# Altium schematic sheet ICs.SchDoc
size 381 x 241 mm; SheetNumber: 3; SheetTotal: 4
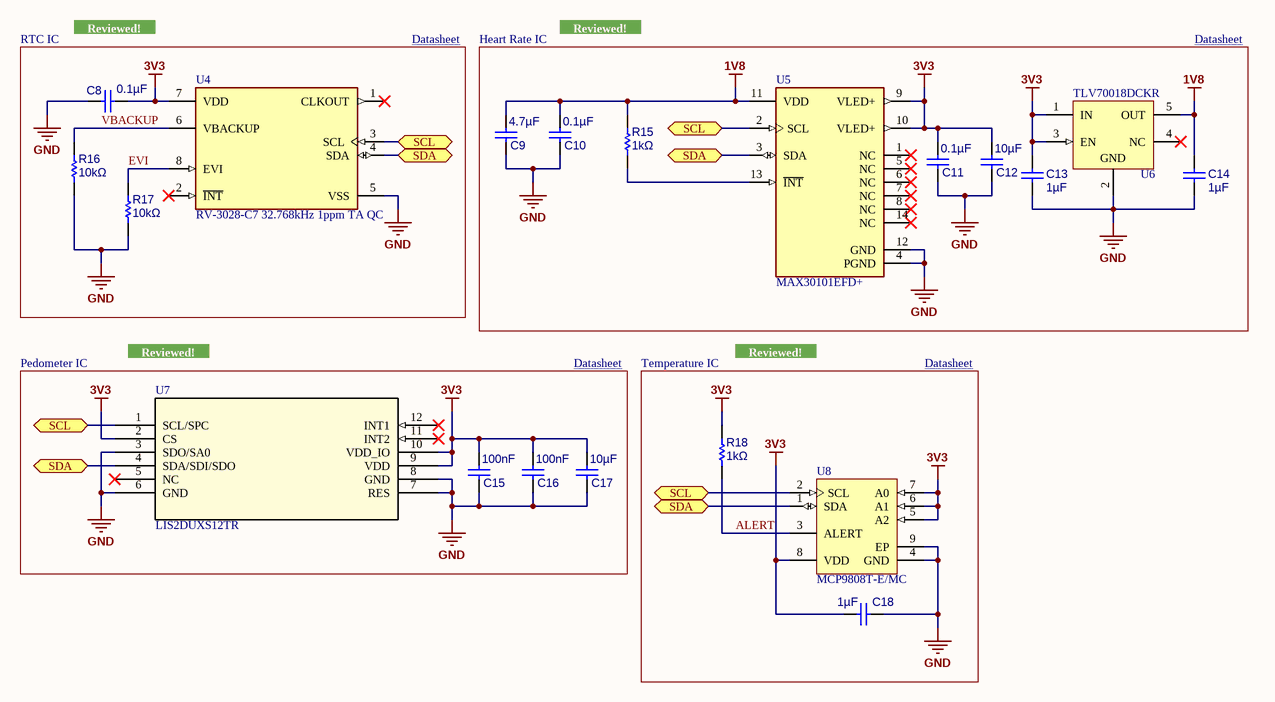
[diagram p0: ICs.SchDoc]

## Parts
C8  0.1µF  [WCAP-CSGP_0603_L1.6W0.8H0.8_Reflow]
C9  4.7µF  [WCAP-CSGP_0603_L1.6W0.8H0.8_Reflow]
C10  0.1µF  [WCAP-CSGP_0603_L1.6W0.8H0.8_Reflow]
C11  0.1µF  [WCAP-CSGP_0603_L1.6W0.8H0.8_Reflow]
C12  10µF  [WCAP-CSGP_0603_L1.6W0.8H0.8_Reflow]
C13  1µF  [WCAP-CSGP_0603_L1.6W0.8H0.8_Reflow]
C14  1µF  [WCAP-CSGP_0603_L1.6W0.8H0.8_Reflow]
C15  100nF  [WCAP-CSGP_0603_L1.6W0.8H0.8_Reflow]
C16  100nF  [WCAP-CSGP_0603_L1.6W0.8H0.8_Reflow]
C17  10µF  [WCAP-CSGP_0603_L1.6W0.8H0.8_Reflow]
C18  1µF  [WCAP-CSGP_0603_L1.6W0.8H0.8_Reflow]
R15  1kΩ  [RESC1608X55X25NL10T15]
R16  10kΩ  [RESC1608X55X25NL10T15]
R17  10kΩ  [RESC1608X55X25NL10T15]
R18  1kΩ  [RESC1608X55X25NL10T15]
U4  RV-3028-C7 32.768kHz 1ppm TA QC  [FP-RV-3028-C7_32_768kHz_1-MFG]
U5  MAX30101EFD+  [FP-F143A5-1-MFG]
U6  TLV70018DCKR  [DCK0005A_L]
U7  LIS2DUXS12TR  [QFN_DUXS12_STM]
U8  MCP9808T-E/MC  [MCHP-DFN-MC8_V]

## Ports
SCL (bidir, see Display[2B], ICs[2C], ICs[3B], ICs[4B], Microcontroller[3A]), SCL (bidir, see Display[2B], ICs[2C], ICs[3B], ICs[4C], Microcontroller[3A]), SCL (bidir, see Display[2B], ICs[2C], ICs[4B], ICs[4C], Microcontroller[3A]), SCL (bidir, see Display[2B], ICs[3B], ICs[4B], ICs[4C], Microcontroller[3A]), SDA (bidir, see Display[2B], ICs[2C], ICs[3B], ICs[4B], Microcontroller[3A]), SDA (bidir, see Display[2B], ICs[2C], ICs[3B], ICs[4C], Microcontroller[3A]), SDA (bidir, see Display[2B], ICs[2C], ICs[4B], ICs[4C], Microcontroller[3A]), SDA (bidir, see Display[2B], ICs[3B], ICs[4B], ICs[4C], Microcontroller[3A])

## Nets
1V8: C9.1 C10.1 C14.2 R15.2 U5.11(VDD) U6.5(OUT)
3V3: C8.1 C11.1 C12.1 C13.2 C15.1 C16.1 C17.1 C18.1 R18.2 U4.7(VDD) U5.9(VLED+) U5.10(VLED+) U6.1(IN) U6.3(EN) U7.2(CS) U7.9(VDD) U7.10(VDD_IO) U8.5(A2) U8.6(A1) U8.7(A0) U8.8(VDD)
GND: C8.2 C9.2 C10.2 C11.2 C12.2 C13.1 C14.1 C15.2 C16.2 C17.2 C18.2 R16.1 R17.1 U4.5(VSS) U5.4(PGND) U5.12(GND) U6.2(GND) U7.3(SDO/SA0) U7.6(GND) U7.7(RES) U7.8(GND) U8.4(GND) U8.9(EP)
ALERT: R18.1 U8.3(ALERT)
EVI: R17.2 U4.8(EVI)
SCL: U4.3(SCL) U5.2(SCL) U7.1(SCL/SPC) U8.2(SCL) ; port SCL
SDA: U4.4(SDA) U5.3(SDA) U7.4(SDA/SDI/SDO) U8.1(SDA) ; port SDA
VBACKUP: R16.2 U4.6(VBACKUP)
NetR15_1: R15.1 U5.13(~{INT})

Not connected (* = marked no-connect by the designer): U4 1(CLKOUT)* 2(~{INT})*; U5 1(NC)* 5(NC)* 6(NC)* 7(NC)* 8(NC)* 14(NC)*; U6 4(NC)*; U7 5(NC)* 11(INT2)* 12(INT1)*

## Notes on the sheet
- Reviewed!
- RTC IC
- Datasheet <https://www.microcrystal.com/fileadmin/Media/Products/RTC/App.Manual/RV-3028-C7_App-Manual.pdf>
- Heart Rate IC
- Datasheet <https://datasheets.maximintegrated.com/en/ds/MAX30101.pdf>
- Pedometer IC
- Datasheet <https://www.st.com/resource/en/datasheet/lis2dux12.pdf>
- Temperature IC
- Datasheet <https://ww1.microchip.com/downloads/en/DeviceDoc/MCP9808-0.5C-Maximum-Accuracy-Digital-Temperature-Sensor-Data-Sheet-DS20005095B.pdf>

## Library data of the parts
C8-C18 = CMP-207839-000060-3: 10V tolerance
R15-R18 = CMP-2000-04186-1
U4 = CMP-226158-000001-1: Real Time Clock Serial 2byte Clock/Calendar/Alarm/Timer/Battery Backup 8-Pin CSMD T/R; Manufacturer: Micro Crystal; Memory Size: 2Bytes; Number Of Outputs: 1; Nominal Supply Current: 0.04uA; Interface: I2C; Max Supply Voltage: 5.5V; Min Supply Voltage: 1.1V; Package: RV-3028-C7 32.768kHz 1ppm TA QC; Lead Free: Yes; RoHS: TRUE; Device Class L1: Integrated Circuits (ICs); Temperature: -40°C to +85°C; ComponentLink2Description: Datasheet; Height: 0.8mm; Octopart: https://octopart.com/rv-3028-c7+32.768khz+1ppm+ta+qc-micro+crystal-98880451; ComponentLink2URL: https://www.microcrystal.com/fileadmin/Media/Products/RTC/Datasheet/RV-3028-C7.pdf; Device Class L2: Clock and Timing; Temperature Range Low: -40°C; Temperature Range High: +85°C; Automotive: No; Device Class L3: Real Time Clocks; Manufacturer Part Number: RV-3028-C7 32.768kHz 1ppm TA QC; Frequency: 32.768kHz; Ambient Temperature Range High: +85°C; Ambient Temperature Range Low: -40°C; Category: IC; Mouser Description: RV-3028-C7 32.768KHZ 1PPM Ta Qc
U5 = CMP-05738-000001-1: INTEGRATED OPTICAL SENSOR; Manufacturer: Maxim Integrated; Max Supply Voltage: 2V; Max Junction Temp: +90°C; Operating Supply Current: 600uA; Min Supply Voltage: 1.7V; Sensor Output: I2C; RoHS: TRUE; Footprint Url: https://pdfserv.maximintegrated.com/land_patterns/90-0602.PDF; Manufacturer Part Number: MAX30101EFD+; Device Class L2: unset; Temperature Range Low: -40°C; Automotive: No; Height: 1.65mm; Temperature Range High: +85°C; ComponentLink2Description: Datasheet; Mouser Description: INTEGRATED OPTICAL SENSOR; ComponentLink2URL: https://datasheets.maximintegrated.com/en/ds/MAX30101.pdf; Octopart: https://octopart.com/max30101efd%2B-maxim+integrated-57054333; Temperature: -40°C to +85°C; Package: F143A5-1; Lead Free: Yes; Device Class L1: Sensors; Digikey Description: INTEGRATED OPTICAL SENSOR; Category: IC; Device Class L3: unset
U6 = CMP-0394-00928-2: Single Output LDO, 200 mA, Fixed 1.8 V Output, 2 to 5.5 V Input, with Low IQ, 5-pin SC70 (DCK), -40 to 125 degC, Green (RoHS & no Sb/Br); Manufacturer: Texas Instruments; Vout Adj(Max)(V): 1.8; Vin(Max)(V): 5.5; SubFamily: Single Channel LDO; Iout(Max)(A): 0.2; Iq(Typ)(mA): 0.03; Accuracy(%): 2; Vdo(Typ)(mV): 175; PartNumber: TLV70018DCKR; ComponentLink3URL: http://www.ti.com/litv/pdf/mpds025f; ComponentLink1URL: http://www.ti.com/; PackageDescription: 5-Pin Plastic Small-Outline, Body 2 x 1.25 mm, Pitch 0.65 mm; DatasheetVersion: SLVSA00D; Eco-Plan: Green (RoHS & no Sb/Br); Mounting Technology: Surface Mount; ComponentLink2URL: http://www.ti.com/general/docs/lit/getliterature.tsp?genericPartNumber=TLV70018&fileType=pdf; ComponentLink3Description: Package Specification; Vout Adj(Min)(V): 1.8; ComponentLink1Description: Manufacturer URL; Code_JEDEC: MO-203; PackageReference: DCK0005A; ComponentLink2Description: Datasheet; Vin(Min)(V): 2; PackageVersion: 4093553-3/G; Fixed Output Options(V): 1.8
U7 = LIS2DUXS12TR: Ultralow-power 3-axis smart accelerometer with Qvar, AI, antialiasing filter, and advanced digital features; Manufacturer_Name: STMicroelectronics; Type: Motion Sensors; Copyright: Copyright (C) 2025 Ultra Librarian. All rights reserved.; Manufacturer_Part_Number: LIS2DUXS12TR; RefDes: RefDes
U8 = CMP-0192-00342-1: + / - 0.5 degC Maximum Accuracy Digital Temperature Sensor, 400 uA, 2.7 to 5.5 V, -40 to 125 degC, 8-pin DFN (MC8), Tape and Reel; Manufacturer: Microchip; DatasheetVersion: Rev. A; PartNumber: MCP9808T-E/MC; Mounting Technology: Surface Mount; ComponentLink4Description: Product URL; ComponentLink2URL: http://ww1.microchip.com/downloads/en/DeviceDoc/25095A.pdf; ComponentLink4URL: http://www.microchip.com/MCP9808; ComponentLink1Description: Manufacturer URL; ComponentLink3URL: http://www.microchip.com/stellent/groups/techpub_sg/documents/packagingspec/en012702.pdf; PackageDescription: 8-Lead Plastic Dual Flat, 2 x 3 mm Body, 0.5 mm Pitch; PackageVersion: C04-123C; PackageReference: DFN-MC8; ComponentLink2Description: Datasheet; ComponentLink1URL: http://www.microchip.com; ComponentLink3Description: Package Specification